# Altium project Arduino Nano Every.PrjPcb
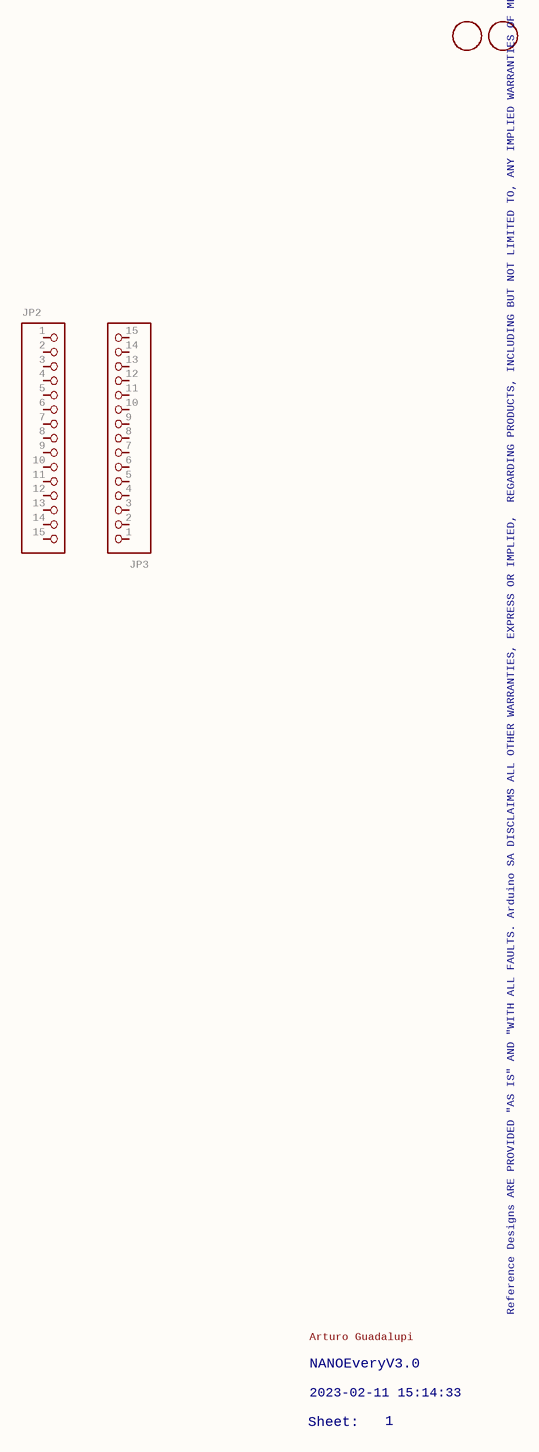
[diagram p0: NANOEveryV3.0.SchDoc]
1 sheet, 4 parts. Net scope: global (net labels, ports and power ports of the same name join across sheets).
Board file: NANOEveryV3.0.PcbDoc

## Sheet NANOEveryV3.0.SchDoc: NANOEveryV3.0
size 411 x 291 mm; Origin: Eagle; Date: 2023-02-11 15:14:33; SheetNumber: 1; CODE-ARDUINO: DNP; DATASHEET: DNP; DISTRIBUTOR-LINK: DNP; DISTRIBUTOR-PN: DNP; MANUFACTURER: DNP; MANUFACTURER-PN: DNP; NOTE: DNP; Value: DNP; GateName_1: G$1; SymbolName_1: A3L-LOC; LibraryName: Arduino-utility; DeviceSetName: A3-FRAME; Sheet: Sheet:; ReferenceDesignsAREPROVIDED"ASIS"AND"WITHALLFAULTS.ArduinoSADISCLAIMSALLOTHERWARRANTIES,EXPRESSORIMPLIED,
REGARDINGPRODUCTS,INCLUDINGBUTNOTLIMITEDTO,ANYIMPLIEDWARRANTIESOFMERCHANTABILITYORFITNESSFORAPARTICULARPURPOSE

ArduinoSAmaymakechangestospecificationsandproductdescriptionsatanytime,withoutnotice.TheCustomermustnot
relyontheabsenceorcharacteristicsofanyfeaturesorinstructionsmarked"reserved"or"undefined."ArduinoSAreserves
theseforfuturedefinitionandshallhavenoresponsibilitywhatsoeverforconflictsorincompatibilitiesarisingfromfuturechangestothem.
TheproductinformationontheWebSiteorMaterialsissubjecttochangewithoutnotice.Donotfinalizeadesignwiththisinfo

ARDUINOandotherArduinobrandsandlogosandTrademarksofArduinoSA.AllArduinoSATrademarkscannotbeusedwithoutowner'sformalpermission: Reference Designs ARE PROVIDED "AS IS" AND "WITH ALL FAULTS. Arduino SA DISCLAIMS ALL OTHER WARRANTIES, EXPRESS OR IMPLIED, / REGARDING PRODUCTS, INCLUDING BUT NOT LIMITED TO, ANY IMPLIED WARRANTIES OF MERCHANTABILITY OR FITNESS FOR A PARTICULAR PURPOSE / Arduino SA may make changes to specifications and product descriptions at any time, without notice. The Customer must not / rely on the absence or characteristics of any features or instructions marked "reserved" or "undefined." Arduino SA reserves / these for future definition and shall have no responsibility whatsoever for conflicts or incompatibilities arising from future changes to them. / The product information on the Web Site or Materials is subject to change without notice. Do not finalize a design with this info / ARDUINO and other Arduino brands and logos and Trademarks of Arduino SA. All Arduino SA Trademarks cannot be used without owner's formal permission; ThisworkislicensedunderaCreativeCommonsAttribution-ShareAlike4.0InternationalLicense.: This work is licensed under a Creative Commons Attribution-ShareAlike 4.0 International License.

### Parts
FD1  DNP  [FD-1-1.5]  (value not drawn)
FD2  DNP  [FD-1-1.5]  (value not drawn)
JP2  (no value)  [1X15-CASTELL]
JP3  (no value)  [1X15-CASTELL]

### Nets

Not connected (* = marked no-connect by the designer): JP2 1 2 3 4 5 6 7 8 9 10 11 12 13 14 15; JP3 1 2 3 4 5 6 7 8 9 10 11 12 13 14 15

### Notes on the sheet
- (near FD2) Reference Designs ARE PROVIDED "AS IS" AND "WITH ALL FAULTS. Arduino SA DISCLAIMS ALL OTHER WARRANTIES, EXPRESS OR IMPLIED,
  REGARDING PRODUCTS, INCLUDING BUT NOT LIMITED TO, ANY IMPLIED WARRANTIES OF MERCHANTABILITY OR FITNESS FOR A PARTICULAR PURPOSE
  Arduino SA may make changes to specifications and product descriptions at any time, without notice. The Customer must not
  rely on the absence or characteristics of any features or instructions marked "reserved" or "undefined." Arduino SA reserves
  these for future definition and shall have no responsibility whatsoever for conflicts or incompatibilities arising from future changes to them.
  The product information on the Web Site or Materials is subject to change without notice. Do not finalize a design with this info
  ARDUINO and other Arduino brands and logos and Trademarks of Arduino SA. All Arduino SA Trademarks cannot be used without owner's formal permission
- Arturo Guadalupi
- NANOEveryV3.0
- Sheet:
- 2023-02-11 15:14:33
- 1

### Library data of the parts
FD1 FD2 = FIDUCIAL-1.5MM: Fiducial mount; GateName_1: G$1; SymbolName_1: ARDUINO_FIDUCIAL; DeviceName: -1.5MM; LibraryName: Arduino-utility; DeviceSetName: FIDUCIAL; CODE-ARDUINO: DNP; DATASHEET: DNP; DISTRIBUTOR-LINK: DNP; DISTRIBUTOR-PN: DNP; MANUFACTURER: DNP; MANUFACTURER-PN: DNP
JP2 JP3 = PINHD-1X15-CASTELLATED: PIN HEADER; GateName_1: A; SymbolName_1: ARDUINO-CONNECTORS_PINHD15; CODE-ARDUINO: 0646; NOTE: DNM; DeviceName: -CASTELLATED; LibraryName: Arduino-connectors; DeviceSetName: PINHD-1X15; DATASHEET: -; DISTRIBUTOR-LINK: -; DISTRIBUTOR-PN: -; MANUFACTURER: -; MANUFACTURER-PN: -